# Altium schematic sheet Power.SchDoc
size A4; Organization: Memristor-Robotics; Address1: Vladimira Perića Valtera; Address2: Novi Sad, 21000; Address3: Serbia; SheetNumber: 3; SheetTotal: 5
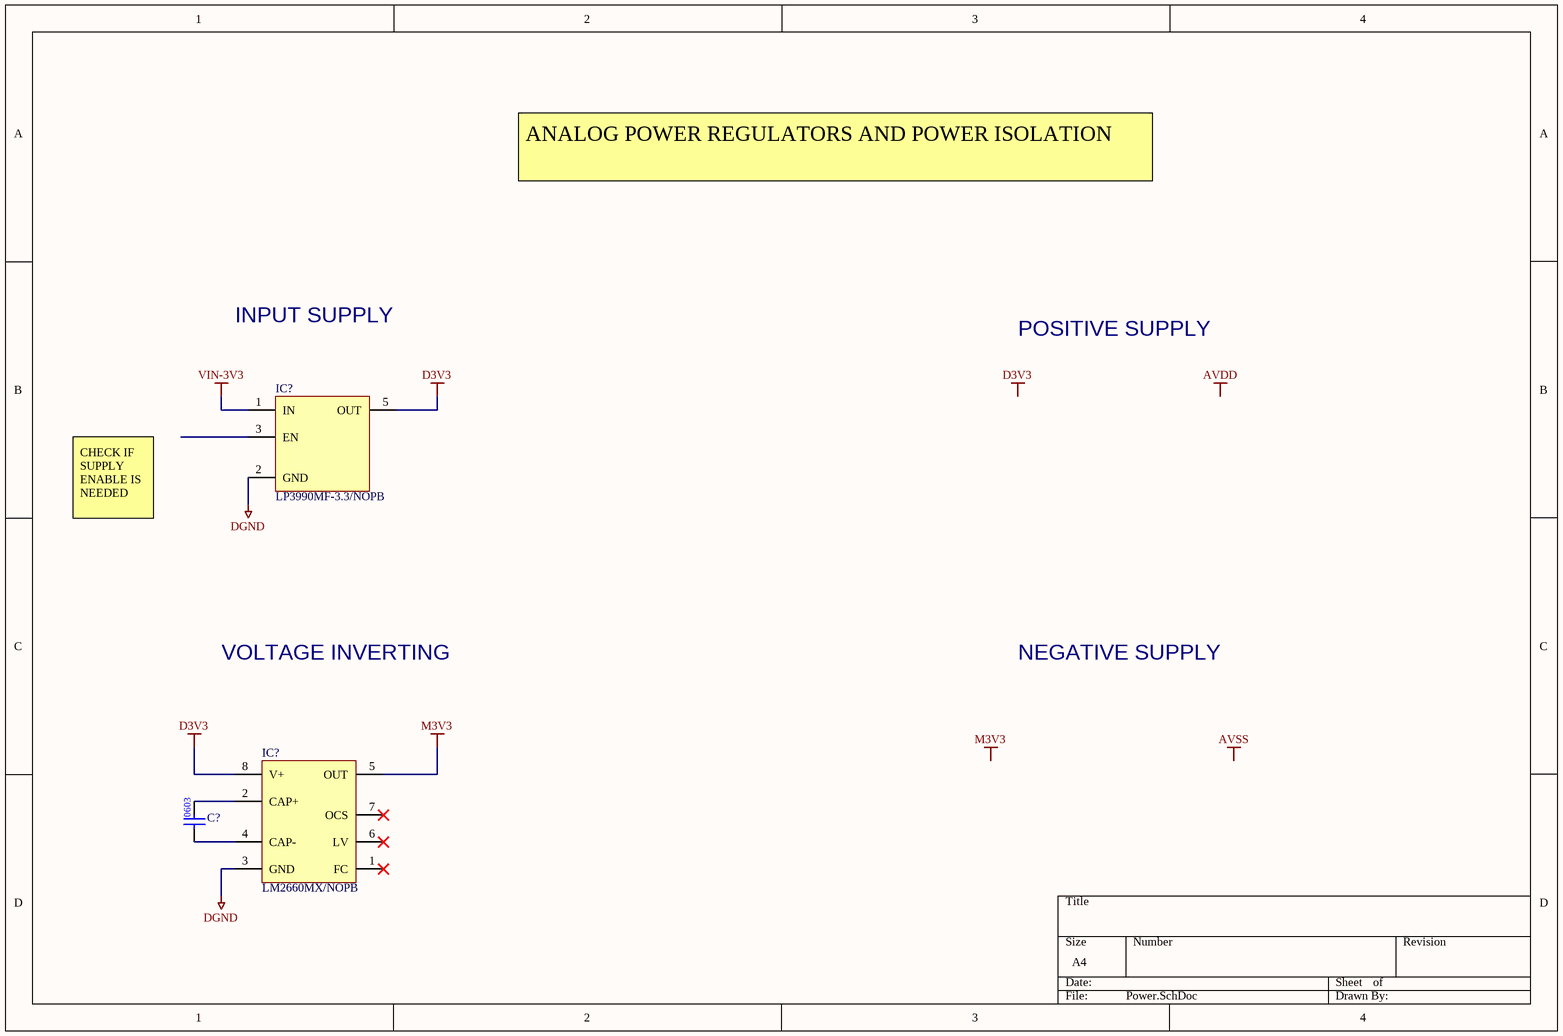
[diagram p0: Power.SchDoc]

## Parts
(Parts that share a designator on the sheet are numbered #1, #2 ... from top to bottom, then left to right.)
C?  CAP_0603  [CAP0603]  (value not drawn)
IC?#1  LP3990MF-3.3/NOPB  [SOT95P280X145-5N]
IC?#2  LM2660MX/NOPB  [SOIC127P599X175-8N]

## Nets
D3V3: IC?#1.5(OUT) IC?#2.8(V+)
DGND: IC?#1.2(GND) IC?#2.3(GND)
M3V3: IC?#2.5(OUT)
VIN-3V3: IC?#1.1(IN)
NetC?_1: C?.1 IC?#2.4(CAP-)
NetC?_2: C?.2 IC?#2.2(CAP+)

Not connected (* = marked no-connect by the designer): IC?#1 3(EN); IC?#2 1(FC)* 6(LV)* 7(OCS)*

## Notes on the sheet
- ANALOG POWER REGULATORS AND POWER ISOLATION
- INPUT SUPPLY
- POSITIVE SUPPLY
- CHECK IF SUPPLY ENABLE IS NEEDED
- VOLTAGE INVERTING
- NEGATIVE SUPPLY
- Labels drawn without touching a wire or pin: AVDD, AVSS, D3V3, M3V3
- Title
- Date:
- Design Engineer:
- Time:
- Revision:
- Sheet
- of
- Size:
- A4
- www.memristor-robotics.io
- File:

## Library data of the parts
C? = CAP_0603: Generic 0603 cap; Manufacturer 1: *; Manufacturer Part Number 1: *; Supplier 1: *; Supplier Part Number 1: *; Value: *; Voltage Rating: *; Package: 0603; Mounting Type: Surface Mount
IC?#1 = LP3990MF: IC REG LINEAR 3.3V 150MA SOT23-5; Manufacturer: Texas Instruments; Input Voltage: 6V; Manufacturer Part Number: LP3990MF-3.3/NOPB; Output Current: 150mA; Topology: Linear; ComponentLink1Description: Datasheet; ComponentLink1URL: https://www.ti.com/lit/ds/symlink/lp3990.pdf?ts=1633191563532; Output Voltage: 3.3V; Supplier 1: Mouser; Supplier Part Number 1: 926-LP3990MF-3.3NOPB; Supplier 2: Digi-Key; Supplier Part Number 2: LP3990MF-3.3/NOPBCT-ND
IC?#2 = LM2660MX: IC REG CHARGE PUMP INV 8SOIC; Manufacturer: Texas Instruments; Input Voltage: 1.5V - 5.5V; Output Current: 100mA; Manufacturer Part Number: LM2660MX/NOPB; Topology: Charge Pump; Supplier 1: Mouser; Supplier Part Number 1: 926-LM2660MX/NOPB; Supplier 2: Digi-Key; Supplier Part Number 2: LM2660MX/NOPBCT-ND; Supplier 3: LCSC; Supplier Part Number 3: C183083; ComponentLink1Description: Datasheet; ComponentLink1URL: https://www.ti.com/lit/ds/symlink/lm2660.pdf?HQS=dis-mous-null-mousermode-dsf-pf-null-wwe&ts=1633188209511&ref_url=https%253A%252F%252Feu.mouser.com%252F